# Altium schematic sheet lm2576.SchDoc
size A4
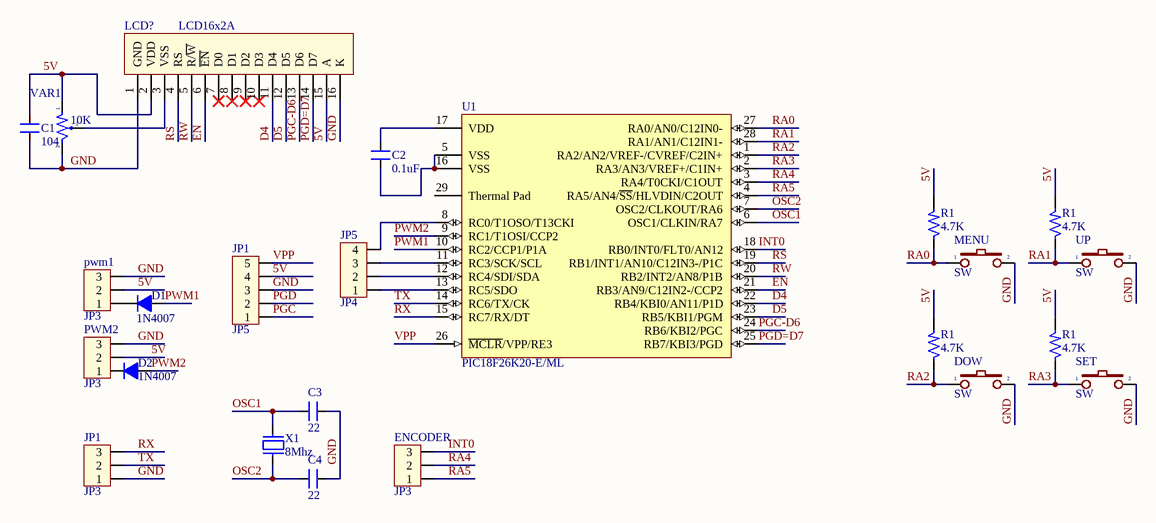
[diagram p0: lm2576.SchDoc]

## Parts
(Parts that share a designator on the sheet are numbered #1, #2 ... from top to bottom, then left to right.)
C1  104  [SM-0805]
C2  0.1uF  [SM-0805]
C3  22  [SM-0805]
C4  22  [SM-0805]
D1  1N4007  [D1A]
D2  1N4007  [D1A]
DOW  SW  [SW2]
ENCODER  JP3  [CON3]
JP1#1  JP5  [CON5]
JP1#2  JP3  [CON3]
JP5  JP4  [CON4]
LCD?  LCD16x2A  [LCD16X2]
MENU  SW  [SW2]
pwm1  JP3  [CON3]
PWM2  JP3  [CON3]
R1#1  4.7K  [SM-1206]
R1#2  4.7K  [SM-1206]
R1#3  4.7K  [SM-1206]
R1#4  4.7K  [SM-1206]
SET  SW  [SW2]
U1  PIC18F26K20-E/ML  [QFN-ML28_N]
UP  SW  [SW2]
VAR1  10K  [VOL-S]
X1  8Mhz  [XT2]

## Nets
5V: C1.2 JP1#1.4 LCD?.2(VDD) LCD?.15(A) pwm1.2 PWM2.2 R1#1.2 R1#2.2 R1#3.2 R1#4.2 VAR1.1
D4: LCD?.11(D4) U1.22(RB4/KBI0/AN11/P1D)
D5: LCD?.12(D5) U1.23(RB5/KBI1/PGM)
EN: LCD?.6(~{EN}) U1.21(RB3/AN9/C12IN2-/CCP2)
GND: C1.1 C3.1 C4.1 DOW.2 JP1#1.3 JP1#2.1 LCD?.1(GND) LCD?.16(K) MENU.2 pwm1.3 PWM2.3 SET.2 UP.2 VAR1.3
INT0: ENCODER.3 U1.18(RB0/INT0/FLT0/AN12)
OSC1: C3.2 U1.6(OSC1/CLKIN/RA7) X1.2
OSC2: C4.2 U1.7(OSC2/CLKOUT/RA6) X1.1
PGC: JP1#1.1
PGC-D6: LCD?.13(D6) U1.24(RB6/KBI2/PGC)
PGD: JP1#1.2
PGD=D7: LCD?.14(D7) U1.25(RB7/KBI3/PGD)
PWM1: D1.1(A) U1.10(RC2/CCP1/P1A)
PWM2: D2.1(A) U1.9(RC1/T1OSI/CCP2)
RA0: MENU.1 R1#1.1 U1.27(RA0/AN0/C12IN0-)
RA1: R1#2.1 U1.28(RA1/AN1/C12IN1-) UP.1
RA2: DOW.1 R1#3.1 U1.1(RA2/AN2/VREF-/CVREF/C2IN+)
RA3: R1#4.1 SET.1 U1.2(RA3/AN3/VREF+/C1IN+)
RA4: ENCODER.2 U1.3(RA4/T0CKI/C1OUT)
RA5: ENCODER.1 U1.4(RA5/AN4/~{SS}/HLVDIN/C2OUT)
RS: LCD?.4(RS) U1.19(RB1/INT1/AN10/C12IN3-/P1C)
RW: LCD?.5(R/~{W}) U1.20(RB2/INT2/AN8/P1B)
RX: JP1#2.3 U1.15(RC7/RX/DT)
TX: JP1#2.2 U1.14(RC6/TX/CK)
VPP: JP1#1.5 U1.26(~{MCLR}/VPP/RE3)
NetC2_1: C2.1 U1.5(VSS) U1.16(VSS)
NetC2_2: C2.2 U1.17(VDD)
NetD1_2: D1.2(K) pwm1.1
NetJP5_1: JP5.1 U1.13(RC5/SDO)
NetJP5_2: JP5.2 U1.12(RC4/SDI/SDA)
NetJP5_3: JP5.3 U1.11(RC3/SCK/SCL)
NetJP5_4: JP5.4 U1.8(RC0/T1OSO/T13CKI)
NetLCD?_3: LCD?.3(VSS) VAR1.2

Not connected (* = marked no-connect by the designer): D2 2(K); LCD? 7(D0)* 8(D1)* 9(D2)* 10(D3)*; PWM2 1; U1 29(Thermal_Pad)

## Library data of the parts
C1-C4 = CM: Cap SMD; Value: 103
D1 D2 = D1A: Diode 1A; Value: 1N4007
DOW MENU SET UP = SW2: Switch button 2 pin; Value: SW chip 2 pin
ENCODER JP1#2 pwm1 PWM2 = Con3: Connector 3; Value: Connector 3
JP1#1 = Con5: Connector 5; Value: Connector 5
JP5 = Con4: Connector 4; Value: Connector 4
LCD? = LCD16x2: LCD dipslay 16 char, 2 line; Value: LCD16x2A
R1#1-R1#4 = R: Resistor 1/4W; Value: R1/4W - 1K
U1 = PIC18F26K20-E/ML: Flash Microcontroller with 10-Bit A/D and nanoWatt Technology, 64K Flash, 28-Pin QFN, Extended Temperature Range; FirstPublished: 29-Jan-2009; LatestRevisionDate: 02-Dec-2009; LatestRevisionNote: Updated to datasheet revision F, Sep-2009; DatasheetVersion: revF, Sep-2009; PackageVersion: revBB, Aug-2009; PackageReference: QFN-ML28; Publisher: Altium Limited; PackageDescription: 28-Lead Plastic Quad Flat, No Lead Package (ML) - 6x6 mm Body [QFN] with 0.55 mm Contact Length; Supplier 1: Digi-Key; Supplier Part Number 1: PIC18F26K20-E/ML-ND; Supplier 2: Farnell; Supplier Part Number 2: 1695552; Supplier 3: Newark; Supplier Part Number 3: 88K6000; Code_JEDEC: MO-220; Code_IPC: QFN65P600X600-28V; ComponentLink1Description: Datasheet; ComponentLink1URL: http://ww1.microchip.com/downloads/en/DeviceDoc/41303F.pdf; ComponentLink2Description: Packaging Specification; ComponentLink2URL: http://www.microchip.com/stellent/groups/techpub_sg/documents/packagingspec/en012702.pdf; ComponentLink3Description: Microchip.com Home; ComponentLink3URL: http://www.microchip.com/
VAR1 = VOL-S: Var Resistor; Value: Volume 50k
X1 = XT2: Crystal For all Crystal 2pin.; Value: 4Mhz